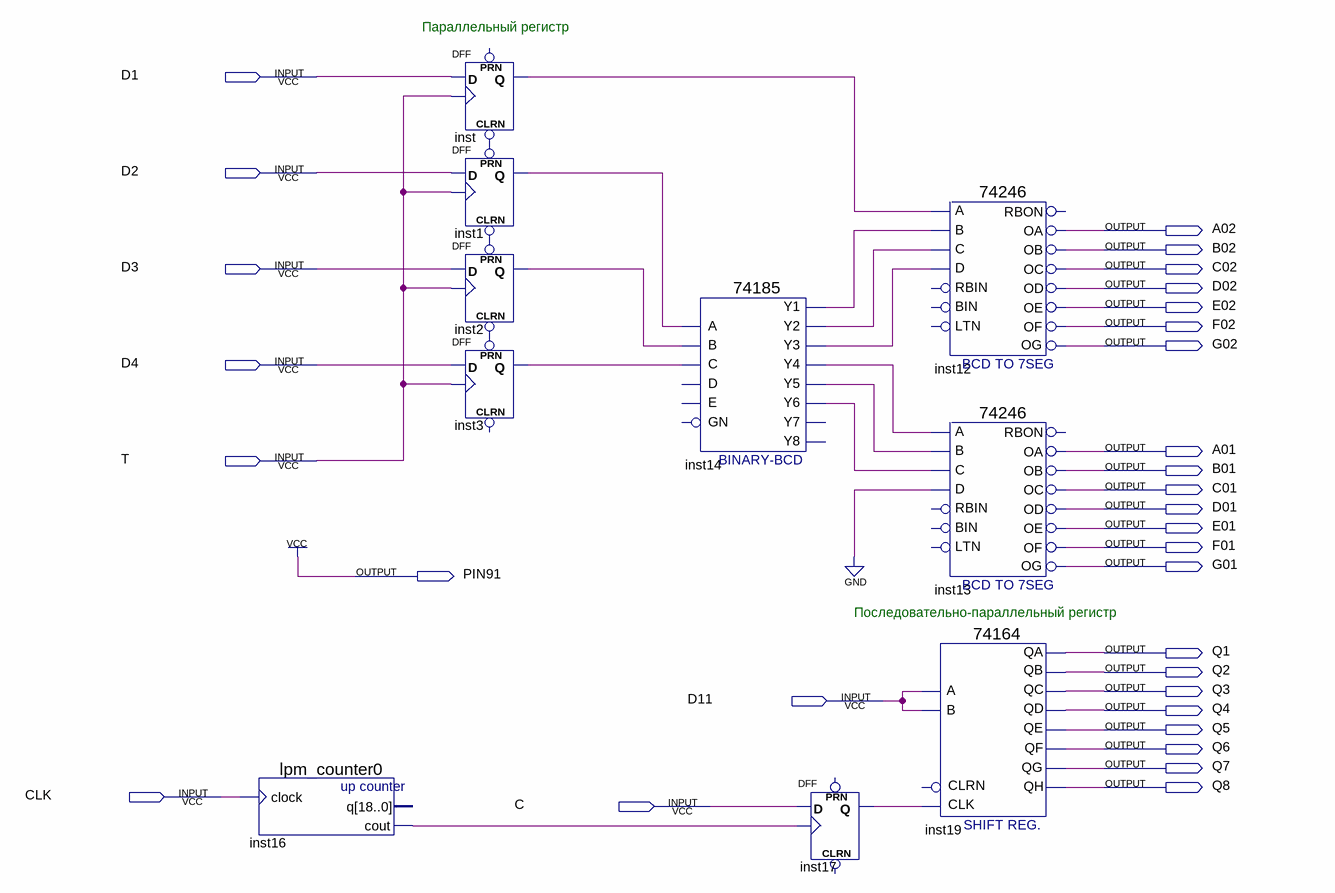
[diagram p0: schematic sheet]
// Quartus schematic Registers.bdf as structural Verilog: 10 symbols, 31 pins
module Registers (
  input  D1,
  input  D2,
  input  D3,
  input  D4,
  input  T,
  input  D11,
  input  CLK,
  input  C,
  output A02,
  output B02,
  output C02,
  output D02,
  output E02,
  output F02,
  output G02,
  output A01,
  output B01,
  output C01,
  output D01,
  output E01,
  output F01,
  output G01,
  output PIN91,
  output Q1,
  output Q2,
  output Q3,
  output Q4,
  output Q5,
  output Q6,
  output Q7,
  output Q8
);

  wire inst1_q, inst2_q, inst3_q, inst14_y1, inst14_y2, inst14_y3, inst14_y4, inst14_y5, inst14_y6,
       inst16_cout, inst17_q, inst_q, undriven, undriven_2, undriven_3;

  lpm_counter0 inst16 (.clock(CLK), .cout(inst16_cout));  // open: q
  DFF inst (.CLRN(undriven), .CLK(T), .D(D1), .Q(inst_q));  // open: PRN
  DFF inst1 (.CLRN(undriven_2), .CLK(T), .D(D2), .PRN(undriven), .Q(inst1_q));
  DFF inst2 (.CLRN(undriven_3), .CLK(T), .D(D3), .PRN(undriven_2), .Q(inst2_q));
  DFF inst3 (.CLK(T), .D(D4), .PRN(undriven_3), .Q(inst3_q));  // open: CLRN
  \74185  inst14 (
    .A(inst1_q), .B(inst2_q), .C(inst3_q), .Y1(inst14_y1), .Y3(inst14_y3), .Y2(inst14_y2), .Y5(inst14_y5),
    .Y4(inst14_y4), .Y6(inst14_y6));  // open: D, E, GN, Y8, Y7
  DFF inst17 (.CLK(inst16_cout), .D(C), .Q(inst17_q));  // open: CLRN, PRN
  \74246  inst12 (
    .B(inst14_y1), .A(inst_q), .D(inst14_y3), .C(inst14_y2), .OD(D02), .OC(C02), .OB(B02), .OE(E02),
    .OF(F02), .OA(A02), .OG(G02));  // open: RBIN, LTN, BIN, RBON
  \74246  inst13 (
    .B(inst14_y5), .A(inst14_y4), .D(1'b0), .C(inst14_y6), .OD(D01), .OC(C01), .OB(B01), .OE(E01), .OF(F01),
    .OA(A01), .OG(G01));  // open: RBIN, LTN, BIN, RBON
  \74164  inst19 (
    .CLK(inst17_q), .B(D11), .A(D11), .QD(Q4), .QC(Q3), .QA(Q1), .QF(Q6), .QH(Q8), .QG(Q7), .QE(Q5), .QB(Q2));  // open: CLRN

  assign PIN91 = 1'b1;

  // Notes on the sheet:
  //   Параллельный регистр
  //   Последовательно-параллельный регистр
endmodule
